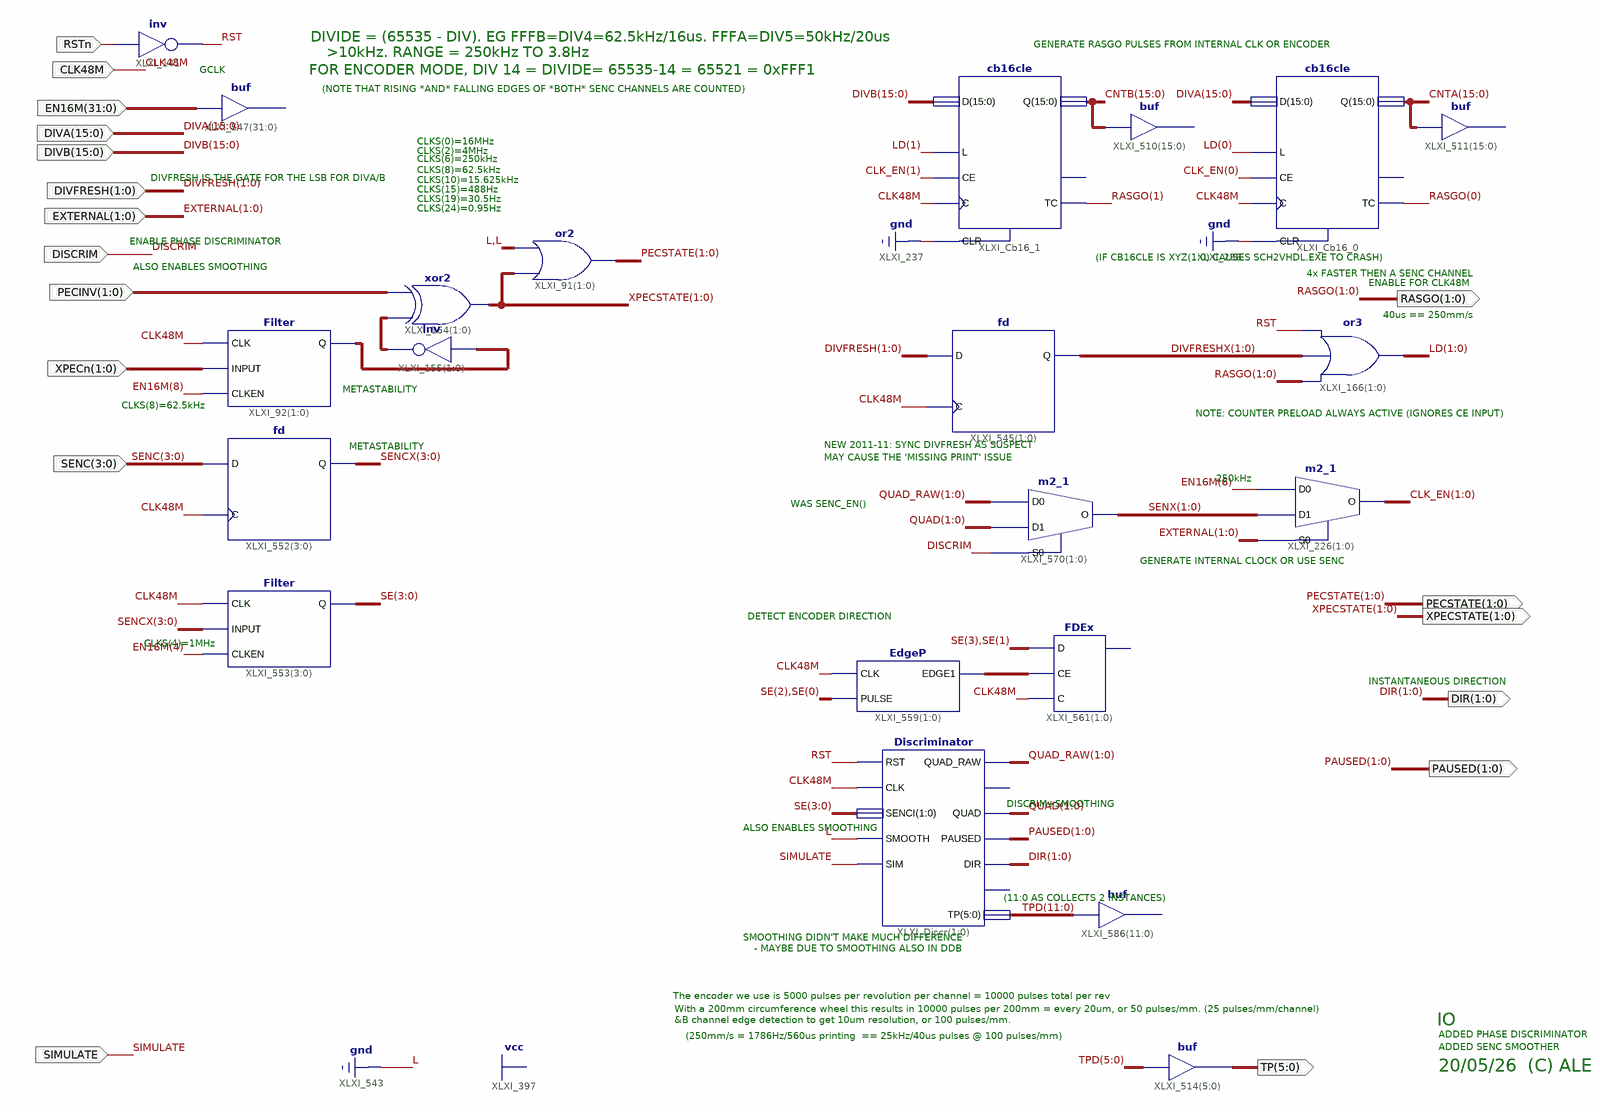
[diagram p0: schematic sheet 1]
// Xilinx ISE schematic Io.sch (spartan6) as structural Verilog: 21 symbols, 18 ports
module Io (
  input  [1:0] DIVFRESH,
  input  [1:0] PECINV,
  input  [1:0] EXTERNAL,
  input  CLK48M,
  input  RSTn,
  input  [15:0] DIVA,
  input  [15:0] DIVB,
  input  [31:0] EN16M,
  input  [1:0] XPECn,
  input  [3:0] SENC,
  input  DISCRIM,
  input  SIMULATE,
  output [1:0] PECSTATE,
  output [1:0] XPECSTATE,
  output [1:0] RASGO,
  output [5:0] TP,
  output [1:0] DIR,
  output [1:0] PAUSED
);

  wire RST;
  wire [1:0] CLK_EN, DIVFRESHX, LD, QUAD, QUAD_RAW, SENX, XLXN_153, XLXN_310, XLXN_606;
  wire [3:0] SE, SENCX;
  wire [11:0] TPD;
  wire [15:0] CNTA, CNTB;

  not XLXI_141 (RST, RSTn);
  assign XLXN_310 = ~XLXN_153;  // inv XLXI_155[1..0], 2 bits wide
  assign XPECSTATE = XLXN_310 ^ PECINV;  // xor2 XLXI_154[1..0], 2 bits wide
  assign PECSTATE = XPECSTATE | 2'b00;  // or2 XLXI_91[1..0], 2 bits wide
  // buf XLXI_511[15..0] has open pins: I=CNTA, O=open
  cb16cle XLXI_Cb16_1 (
    .C(CLK48M), .CE(CLK_EN[1]), .CLR(1'b0), .D(DIVB), .L(LD[1]), .Q(CNTB), .TC(RASGO[1]));  // open: CEO
  cb16cle XLXI_Cb16_0 (
    .C(CLK48M), .CE(CLK_EN[0]), .CLR(1'b0), .D(DIVA), .L(LD[0]), .Q(CNTA), .TC(RASGO[0]));  // open: CEO
  assign LD = RASGO | DIVFRESHX | {2{RST}};  // or3 XLXI_166[1..0], 2 bits wide
  // buf XLXI_510[15..0] has open pins: I=CNTB, O=open
  assign TP = TPD[5:0];  // buf XLXI_514[5..0], 6 bits wide
  // buf XLXI_547[31..0] has open pins: I=EN16M, O=open
  Filter XLXI_92[1:0] (.CLK(CLK48M), .CLKEN(EN16M[8]), .INPUT(XPECn), .Q(XLXN_153));
  fd XLXI_552[3:0] (.C(CLK48M), .D(SENC), .Q(SENCX));
  fd XLXI_545[1:0] (.C(CLK48M), .D(DIVFRESH), .Q(DIVFRESHX));
  m2_1 XLXI_570[1:0] (.D0(QUAD_RAW), .D1(QUAD), .S0(DISCRIM), .O(SENX));
  m2_1 XLXI_226[1:0] (.D0(EN16M[6]), .D1(SENX), .S0(EXTERNAL), .O(CLK_EN));
  EdgeP XLXI_559[1:0] (.CLK(CLK48M), .EDGE1(XLXN_606), .PULSE({SE[2], SE[0]}));
  FDEx XLXI_561[1:0] (.C(CLK48M), .CE(XLXN_606), .D({SE[3], SE[1]}));  // open: Q
  Filter XLXI_553[3:0] (.CLK(CLK48M), .CLKEN(EN16M[4]), .INPUT(SENCX), .Q(SE));
  // buf XLXI_586[11..0] has open pins: I=TPD, O=open
  Discriminator XLXI_Discr[1:0] (
    .RST(RST), .QUAD_RAW(QUAD_RAW), .CLK(CLK48M), .SENCI(SE), .SIM(SIMULATE), .SMOOTH(1'b0), .QUAD(QUAD),
    .PAUSED(PAUSED), .DIR(DIR), .TP(TPD));  // open: SENSE, QUAD_SMO

  // Notes on the sheet:
  //   DIVIDE = (65535 - DIV). EG FFFB=DIV4=62.5kHz/16us. FFFA=DIV5=50kHz/20us
  //   GENERATE RASGO PULSES FROM INTERNAL CLK OR ENCODER
  //   >10kHz. RANGE = 250kHz TO 3.8Hz
  //   GCLK
  //   FOR ENCODER MODE, DIV 14 = DIVIDE= 65535-14 = 65521 = 0xFFF1
  //   (NOTE THAT RISING *AND* FALLING EDGES OF *BOTH* SENC CHANNELS ARE COUNTED)
  //   CLKS(0)=16MHz
  //   CLKS(2)=4MHz
  //   CLKS(6)=250kHz
  //   CLKS(8)=62.5kHz
  //   DIVFRESH IS THE GATE FOR THE LSB FOR DIVA/B
  //   CLKS(10)=15.625kHz
  //   CLKS(15)=488Hz
  //   CLKS(19)=30.5Hz
  //   CLKS(24)=0.95Hz
  //   ENABLE PHASE DISCRIMINATOR
  //   (IF CB16CLE IS XYZ(1:0) CAUSES SCH2VHDL.EXE TO CRASH)
  //   ALSO ENABLES SMOOTHING
  //   4x FASTER THEN A SENC CHANNEL
  //   ENABLE FOR CLK48M
  //   40us == 250mm/s
  //   METASTABILITY
  //   CLKS(8)=62.5kHz
  //   NOTE: COUNTER PRELOAD ALWAYS ACTIVE (IGNORES CE INPUT)
  //   NEW 2011-11: SYNC DIVFRESH AS SUSPECT
  //   METASTABILITY
  //   MAY CAUSE THE 'MISSING PRINT' ISSUE
  //   250kHz
  //   WAS SENC_EN()
  //   GENERATE INTERNAL CLOCK OR USE SENC
  //   DETECT ENCODER DIRECTION
  //   CLKS(4)=1MHz
  //   INSTANTANEOUS DIRECTION
  //   DISCRIM+SMOOTHING
  //   ALSO ENABLES SMOOTHING
  //   (11:0 AS COLLECTS 2 INSTANCES)
  //   SMOOTHING DIDN'T MAKE MUCH DIFFERENCE
  //   - MAYBE DUE TO SMOOTHING ALSO IN DDB
  //   The encoder we use is 5000 pulses per revolution per channel = 10000 pulses total per rev
  //   With a 200mm circumference wheel this results in 10000 pulses per 200mm = every 20um, or 50 pulses/mm. (25 pulses/mm/channel)
  //   &B channel edge detection to get 10um resolution, or 100 pulses/mm.
  //   IO
  //   ADDED PHASE DISCRIMINATOR
  //   (250mm/s = 1786Hz/560us printing  == 25kHz/40us pulses @ 100 pulses/mm)
  //   ADDED SENC SMOOTHER
  //   20/05/26  (C) ALE
endmodule
